# Altium schematic sheet Current Sense.SchDoc: Vsense from 0 to 69.3V
size Letter; Date: 2017-02-08; DocumentNumber: 15; Revision: A; SheetNumber: 15; SheetTotal: 16; DesignedBy: Mike MacKay
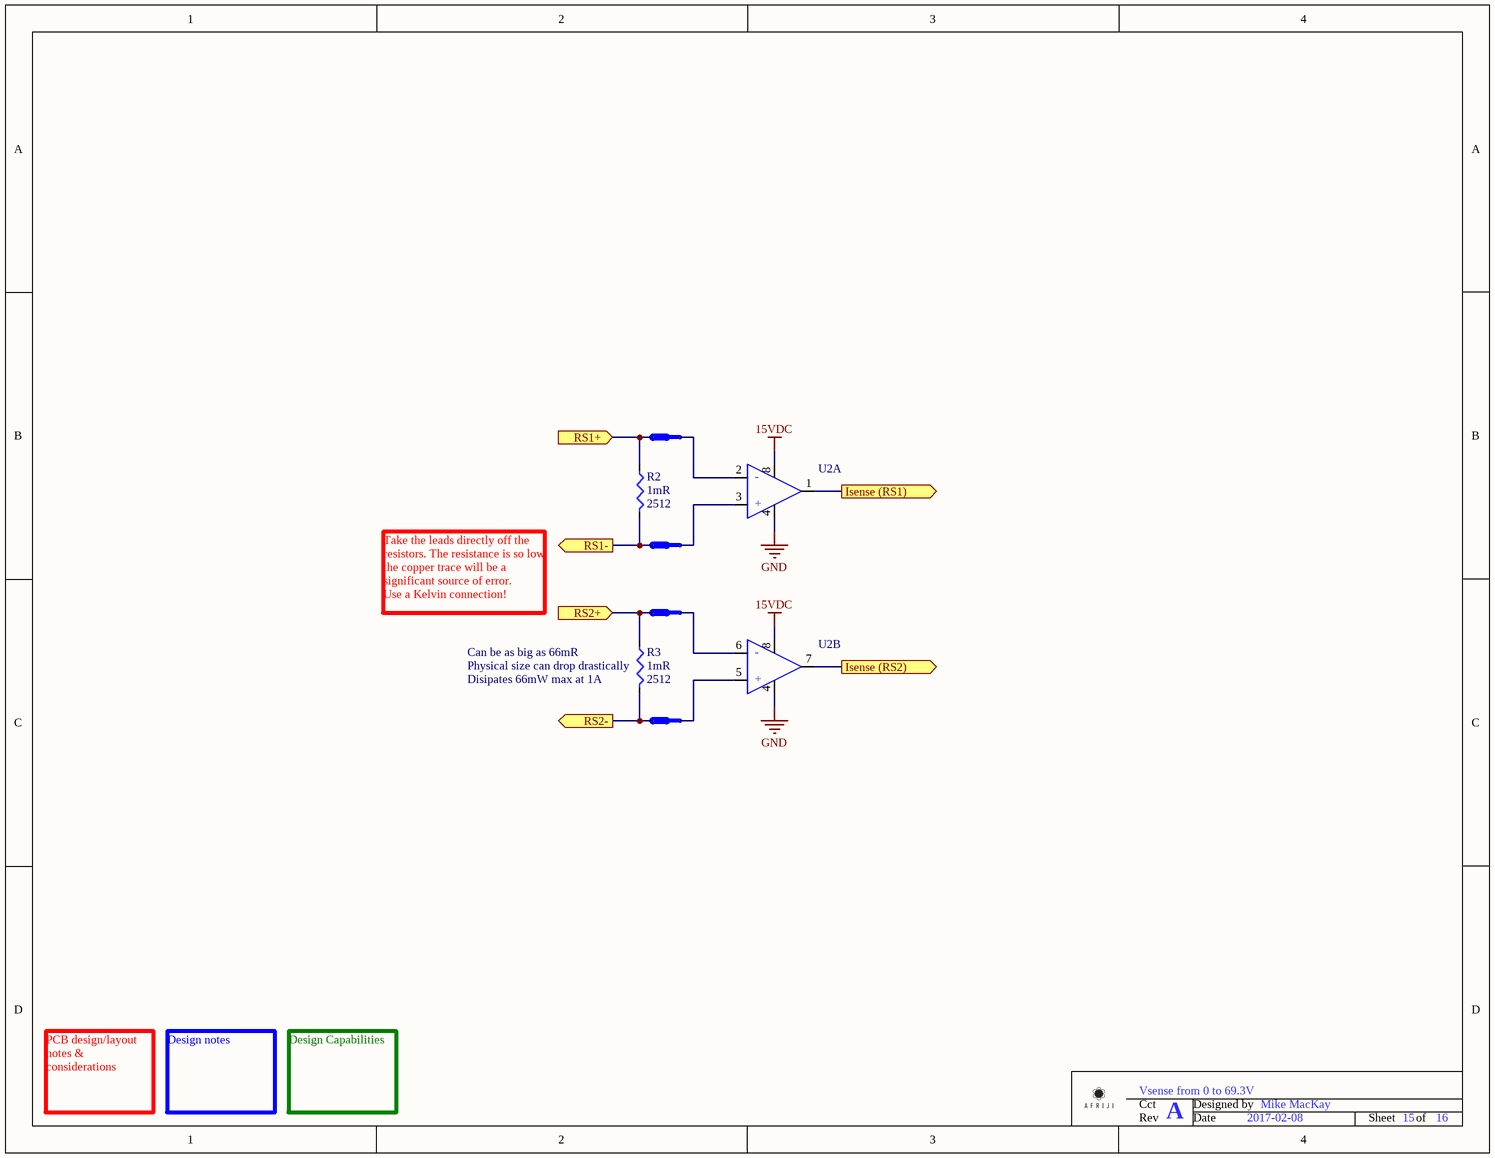
[diagram p0: Current Sense.SchDoc]

## Parts
NetTie3  Net Tie  [Net tie (7/35 mil)]  (value not drawn)  (net tie, no BOM)
NetTie4  Net Tie  [Net tie (7/7 mil)]  (value not drawn)  (net tie, no BOM)
NetTie5  Net Tie  [Net tie (7/35 mil)]  (value not drawn)  (net tie, no BOM)
NetTie6  Net Tie  [Net tie (7/7 mil)]  (value not drawn)  (net tie, no BOM)
R2  Resistance (Ohms): 1mR  Package / Case: 2512  [R2512]  (hidden comment: Template - Resistor)
R3  Note1: Can be as big as 66mR  Note2: Physical size can drop drastically  Note3: Disipates 66mW max at 1A  Resistance (Ohms): 1mR  Package / Case: 2512  [R2512]
U2  Dual High Side Current Sense Amplifier  [SOIC-8 (3.9mm)]  (value not drawn)  (parts A,B of 2)

## Ports
Isense (RS1) (out), Isense (RS2) (out), RS1+ (in), RS1- (out), RS2+ (in), RS2- (out)

## Nets
15VDC: U2.8(VCC)
GND: U2.4(GND)
Isense (RS1): U2.1(Out) ; port Isense (RS1)
Isense (RS2): U2.7(OUT2) ; port Isense (RS2)
RS1+: NetTie3.2 R2.2 ; port RS1+
RS1-: NetTie4.2 R2.1 ; port RS1-
RS2+: NetTie5.2 R3.2 ; port RS2+
RS2-: NetTie6.2 R3.1 ; port RS2-
NetNetTie3_1: NetTie3.1 U2.2(RS1-)
NetNetTie4_1: NetTie4.1 U2.3(RS1+)
NetNetTie5_1: NetTie5.1 U2.6(RS2-)
NetNetTie6_1: NetTie6.1 U2.5(RS2+)

## Notes on the sheet
- Take the leads directly off the resistors. The resistance is so low the copper trace will be a significant source of error.
  Use a Kelvin connection!
- PCB design/layout notes & considerations
- Design notes
- Design Capabilities
- Cct
- Designed by
- Rev
- Date
- Sheet
- of
- (in symbol Dual High Side Current Sense Amplifier, part A) +
- (in symbol Dual High Side Current Sense Amplifier, part B) +

## Library data of the parts
NetTie3-NetTie6 = Net Tie: Ties two nets together
R2 = Template - Resistor: Manufacturer: Yageo; Manufacturer Part Number: PR2512FKG070R001L; Value: 1mR 2512 1%; Tolerance: ±1%; Power (Watts): 1W; Temperature Coefficient: ±200ppm/°C; Supplier 1: Digi-Key; Supplier Part Number 1: 311-0.001AGCT-ND; RoHS: RoHS Compliant; Category: Resistors; Stock 1: 24788; Pricing 1: 1=0.86, 10=0.749, 25=0.6588, 50=0.6018, 100=0.5224, 250=0.45424, 500=0.377, 1000=0.3066 (USD); Packaging: Cut Tape (CT); Part Status: Active; Composition: Thick Film; Features: Current Sense; Operating Temperature: -55°C ~ 170°C; Supplier Device Package: 2512; Size / Dimension: 0.252" L x 0.126" W (6.40mm x 3.20mm); Height - Seated (Max): 0.041" (1.03mm); Number of Terminations: 2; Failure Rate: -; ComponentLink1URL: http://www.yageo.com/NewPortal/yageodocoutput?fileName=/pdf/R-Chip/-PYu-PR_51_RoHS_Z_0.pdf; ComponentLink1Description: Spec Sheet
R3 = Template - Resistor: Manufacturer: Yageo; Manufacturer Part Number: PR2512FKG070R001L; Tolerance: ±1%; Power (Watts): 1W; Temperature Coefficient: ±200ppm/°C; Supplier 1: Digi-Key; Supplier Part Number 1: 311-0.001AGCT-ND; RoHS: RoHS Compliant; Category: Resistors; Stock 1: 24782; Pricing 1: 1=0.86, 10=0.749, 25=0.6588, 50=0.6018, 100=0.5224, 250=0.45424, 500=0.377, 1000=0.3066 (USD); Packaging: Cut Tape (CT); Part Status: Active; Composition: Thick Film; Features: Current Sense; Operating Temperature: -55°C ~ 170°C; Supplier Device Package: 2512; Size / Dimension: 0.252" L x 0.126" W (6.40mm x 3.20mm); Height - Seated (Max): 0.041" (1.03mm); Number of Terminations: 2; Failure Rate: -; ComponentLink1URL: http://www.yageo.com/NewPortal/yageodocoutput?fileName=/pdf/R-Chip/-PYu-PR_51_RoHS_Z_0.pdf; ComponentLink1Description: Spec Sheet
U2 = Dual High Side Current Sense Amplifier: Manufacturer: Maxim Integrated; Manufacturer Part Number: MAX4377FASA+; Number of Circuits: 2; Slew Rate: 10 V/µs; -3db Bandwidth: 1.7MHz; Current - Input Bias: 800µA; Current - Supply: 1mA; Voltage - Supply, Single/Dual (±): 3 V ~ 28 V; Supplier 1: Digi-Key; RoHS: RoHS Compliant; Category: Integrated Circuits (ICs); Stock 1: 695; Pricing 1: 1=1.98, 10=1.881, 50=1.8742 (USD); Packaging: Tube; Part Status: Active; Amplifier Type: Current Sense; Output Type: -; Gain Bandwidth Product: -; Voltage - Input Offset: -; Current - Output / Channel: -; Operating Temperature: -40°C ~ 125°C; Mounting Type: Surface Mount; Package / Case: 8-SOIC (0.154", 3.90mm Width); Supplier Device Package: 8-SOIC; ComponentLink1URL: https://datasheets.maximintegrated.com/en/ds/MAX4376-MAX4378.pdf; ComponentLink1Description: Spec Sheet; Supplier Part Number 1: MAX4377FASA+-ND